# Altium schematic sheet Digital Outputs.SchDoc
size A3; SheetNumber: 3; SheetTotal: 7
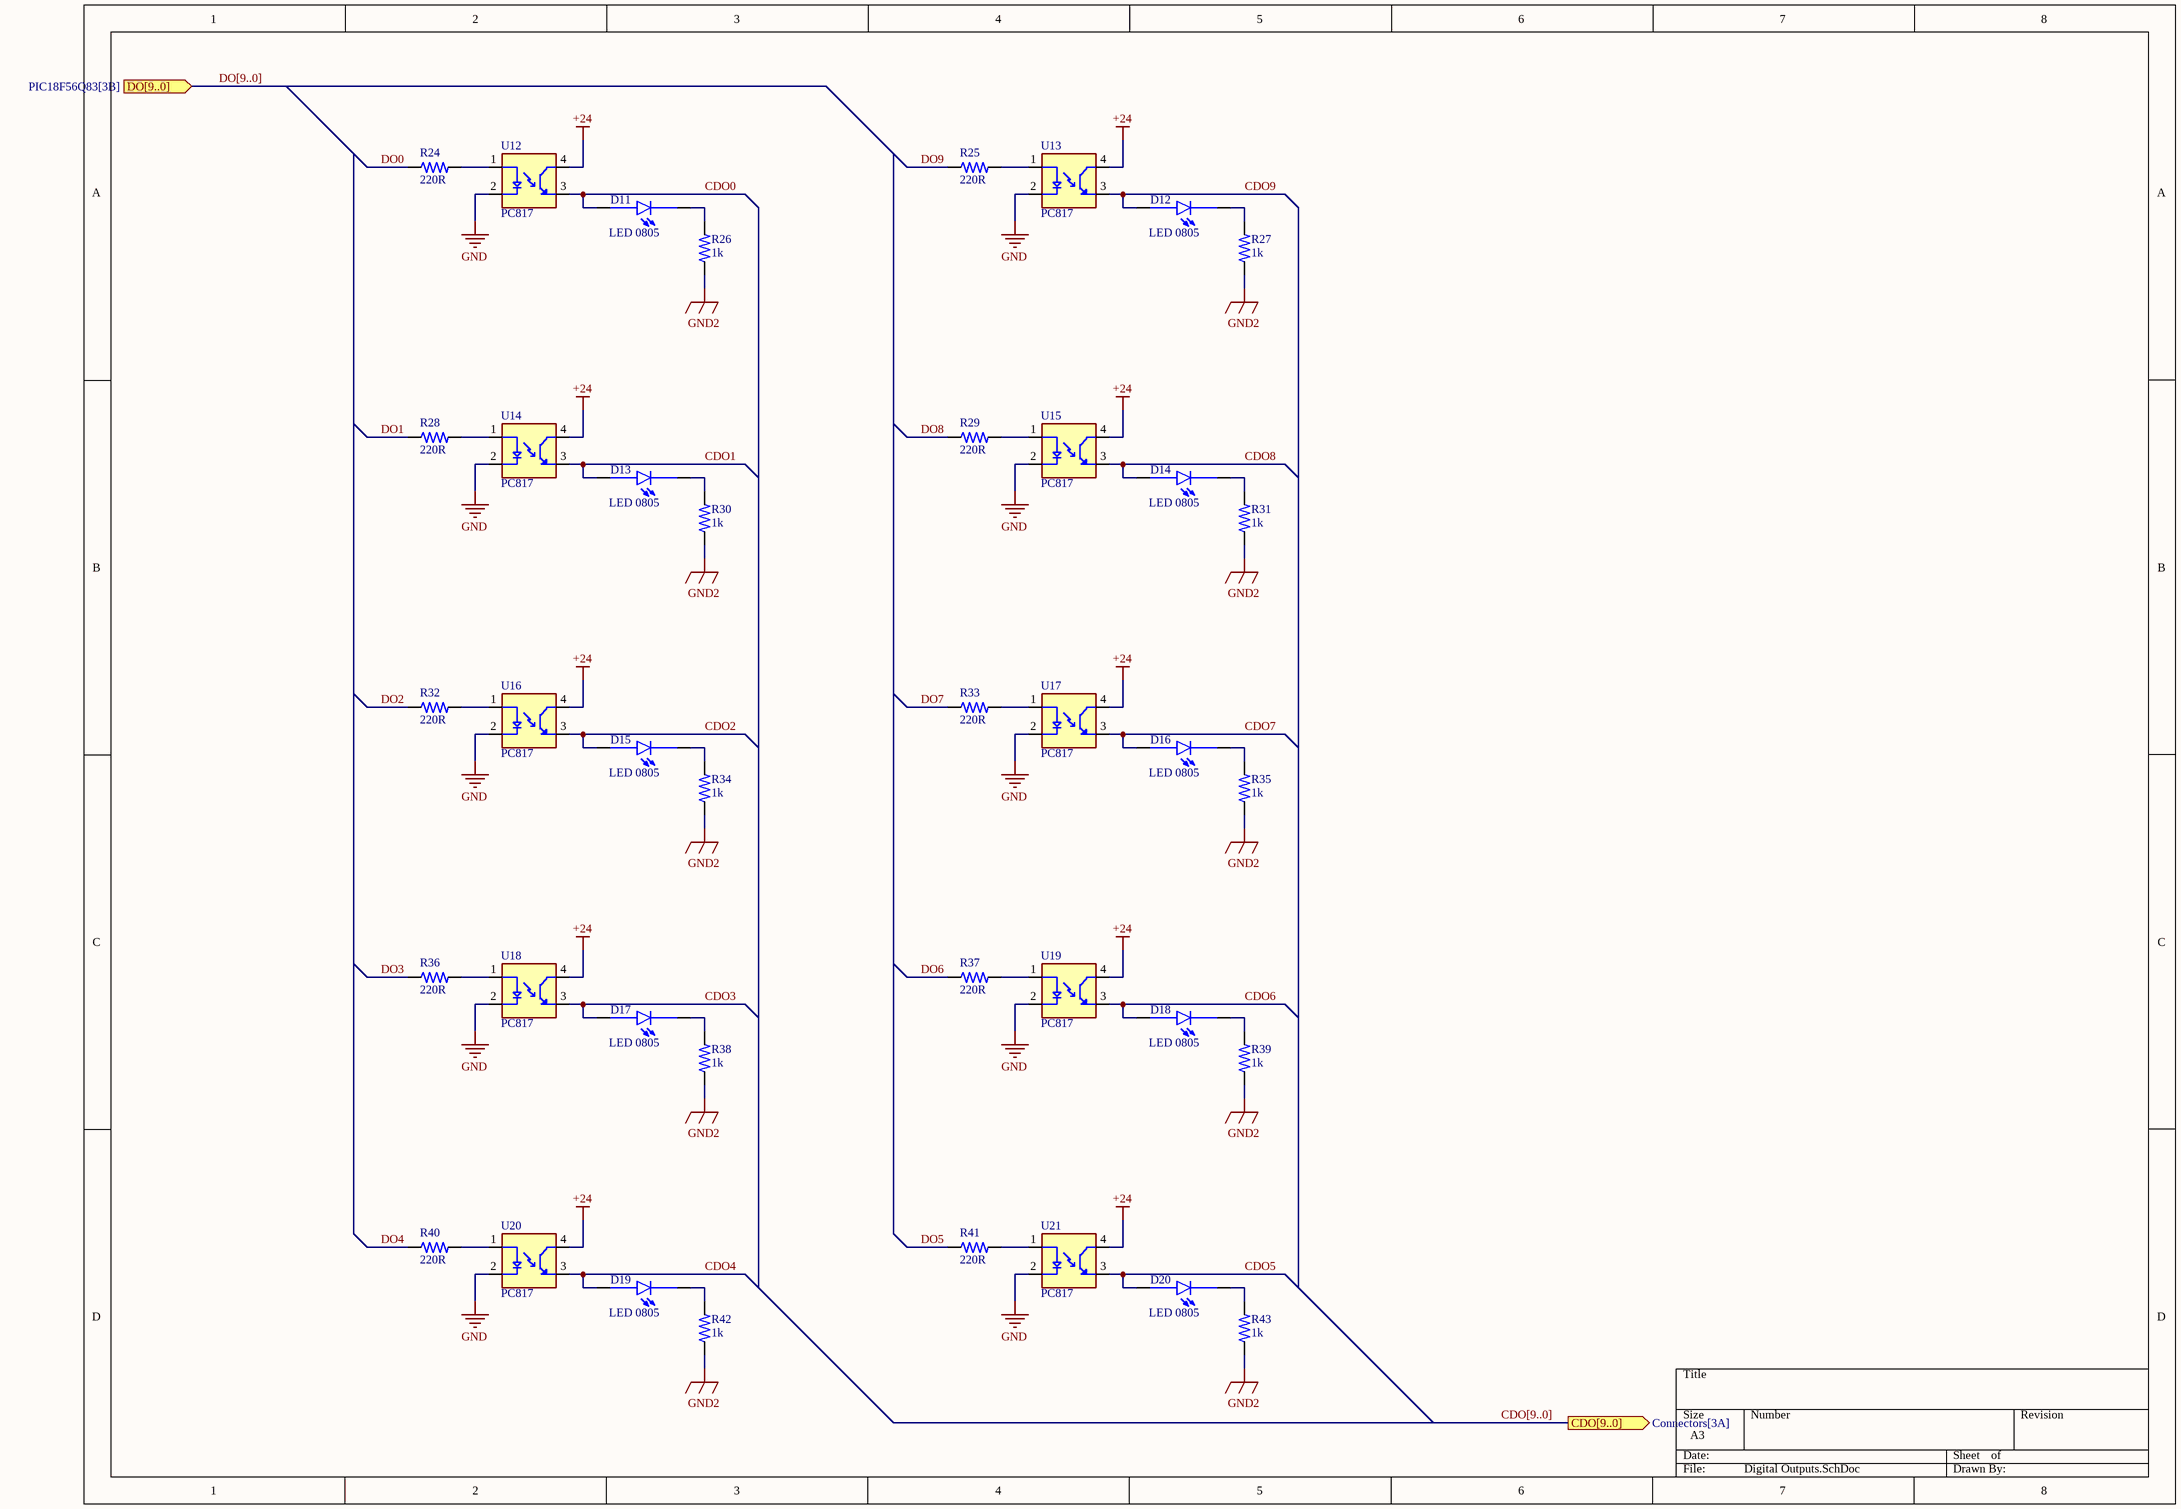
[diagram p0: Digital Outputs.SchDoc]

## Parts
D11  LED 0805  [LED 0805]
D12  LED 0805  [LED 0805]
D13  LED 0805  [LED 0805]
D14  LED 0805  [LED 0805]
D15  LED 0805  [LED 0805]
D16  LED 0805  [LED 0805]
D17  LED 0805  [LED 0805]
D18  LED 0805  [LED 0805]
D19  LED 0805  [LED 0805]
D20  LED 0805  [LED 0805]
R24  220R  [0805]
R25  220R  [0805]
R26  1k  [0805]
R27  1k  [0805]
R28  220R  [0805]
R29  220R  [0805]
R30  1k  [0805]
R31  1k  [0805]
R32  220R  [0805]
R33  220R  [0805]
R34  1k  [0805]
R35  1k  [0805]
R36  220R  [0805]
R37  220R  [0805]
R38  1k  [0805]
R39  1k  [0805]
R40  220R  [0805]
R41  220R  [0805]
R42  1k  [0805]
R43  1k  [0805]
U12  PC817  [PC817]
U13  PC817  [PC817]
U14  PC817  [PC817]
U15  PC817  [PC817]
U16  PC817  [PC817]
U17  PC817  [PC817]
U18  PC817  [PC817]
U19  PC817  [PC817]
U20  PC817  [PC817]
U21  PC817  [PC817]

## Ports
CDO[9..0] (out, see Connectors[3A]), DO[9..0] (in, see PIC18F56Q83[3B])

## Nets
+24: U12.4(CT) U13.4(CT) U14.4(CT) U15.4(CT) U16.4(CT) U17.4(CT) U18.4(CT) U19.4(CT) U20.4(CT) U21.4(CT)
GND: U12.2(C) U13.2(C) U14.2(C) U15.2(C) U16.2(C) U17.2(C) U18.2(C) U19.2(C) U20.2(C) U21.2(C)
GND2: R26.1 R27.1 R30.1 R31.1 R34.1 R35.1 R38.1 R39.1 R42.1 R43.1
CDO0: D11.A U12.3(ET)
CDO1: D13.A U14.3(ET)
CDO2: D15.A U16.3(ET)
CDO3: D17.A U18.3(ET)
CDO4: D19.A U20.3(ET)
CDO5: D20.A U21.3(ET)
CDO6: D18.A U19.3(ET)
CDO7: D16.A U17.3(ET)
CDO8: D14.A U15.3(ET)
CDO9: D12.A U13.3(ET)
DO0: R24.1
DO1: R28.1
DO2: R32.1
DO3: R36.1
DO4: R40.1
DO5: R41.1
DO6: R37.1
DO7: R33.1
DO8: R29.1
DO9: R25.1
NetD11_C: D11.C R26.2
NetD12_C: D12.C R27.2
NetD13_C: D13.C R30.2
NetD14_C: D14.C R31.2
NetD15_C: D15.C R34.2
NetD16_C: D16.C R35.2
NetD17_C: D17.C R38.2
NetD18_C: D18.C R39.2
NetD19_C: D19.C R42.2
NetD20_C: D20.C R43.2
NetR24_2: R24.2 U12.1(A)
NetR25_2: R25.2 U13.1(A)
NetR28_2: R28.2 U14.1(A)
NetR29_2: R29.2 U15.1(A)
NetR32_2: R32.2 U16.1(A)
NetR33_2: R33.2 U17.1(A)
NetR36_2: R36.2 U18.1(A)
NetR37_2: R37.2 U19.1(A)
NetR40_2: R40.2 U20.1(A)
NetR41_2: R41.2 U21.1(A)

## Buses and harness runs
bus CDO[9..0] = port CDO[9..0]
bus DO[9..0] = port DO[9..0]

## Library data of the parts
D11-D20 = LED 0805: LED Uni-Color Green 4-Pin Chip 0805 T/R; MP: 597-3305-607F; Availability: Unavailable; Value: *; Price: None; Package: None
R24-R43 = 0805_Resistor: Power_Rating: .25 W; MP: 2-2176053-0; Tolerance: 1%; Resistance: .33; MF: TE Connectivity; Price: None; Availability: In Stock; EU_RoHS_Compliance: Compliant with Exemptions; Package: 0805; Value: *; SnapEDA_Link: https://www.snapeda.com/parts/2-2176053-0/TE+Connectivity/view-part/?ref=snap; Check_prices: https://www.snapeda.com/parts/2-2176053-0/TE+Connectivity/view-part/?ref=eda
U12-U21 = PC817: Optoisolator Transistor Output 5000Vrms 1 Channel 4-SMD; MP: PC817XI; MF: Sharp Microelectronics; Price: None; Availability: In Stock; Package: SMD-4 Sharp Microelectronics; Value: *; SnapEDA_Link: https://www.snapeda.com/parts/PC817XI/Sharp+Microelectronics/view-part/?ref=snap; Purchase-URL: https://pricing.snapeda.com/search/part/PC817XI/?ref=eda; Check_prices: https://www.snapeda.com/parts/PC817XI/Sharp+Microelectronics/view-part/?ref=eda